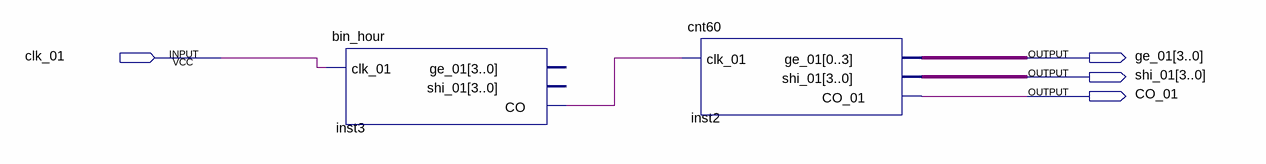
[diagram p0: schematic sheet]
// Quartus schematic bin_min.bdf as structural Verilog: 2 symbols, 4 pins
module bin_min (
  input  clk_01,
  output [3:0] ge_01,
  output [3:0] shi_01,
  output CO_01
);

  wire inst3_co;

  bin_hour inst3 (.clk_01(clk_01), .CO(inst3_co));  // open: ge_01, shi_01
  cnt60 inst2 (.clk_01(inst3_co), .ge_01(ge_01), .shi_01(shi_01), .CO_01(CO_01));
endmodule
